# EAGLE schematic sch (EAGLE 9.3.2)
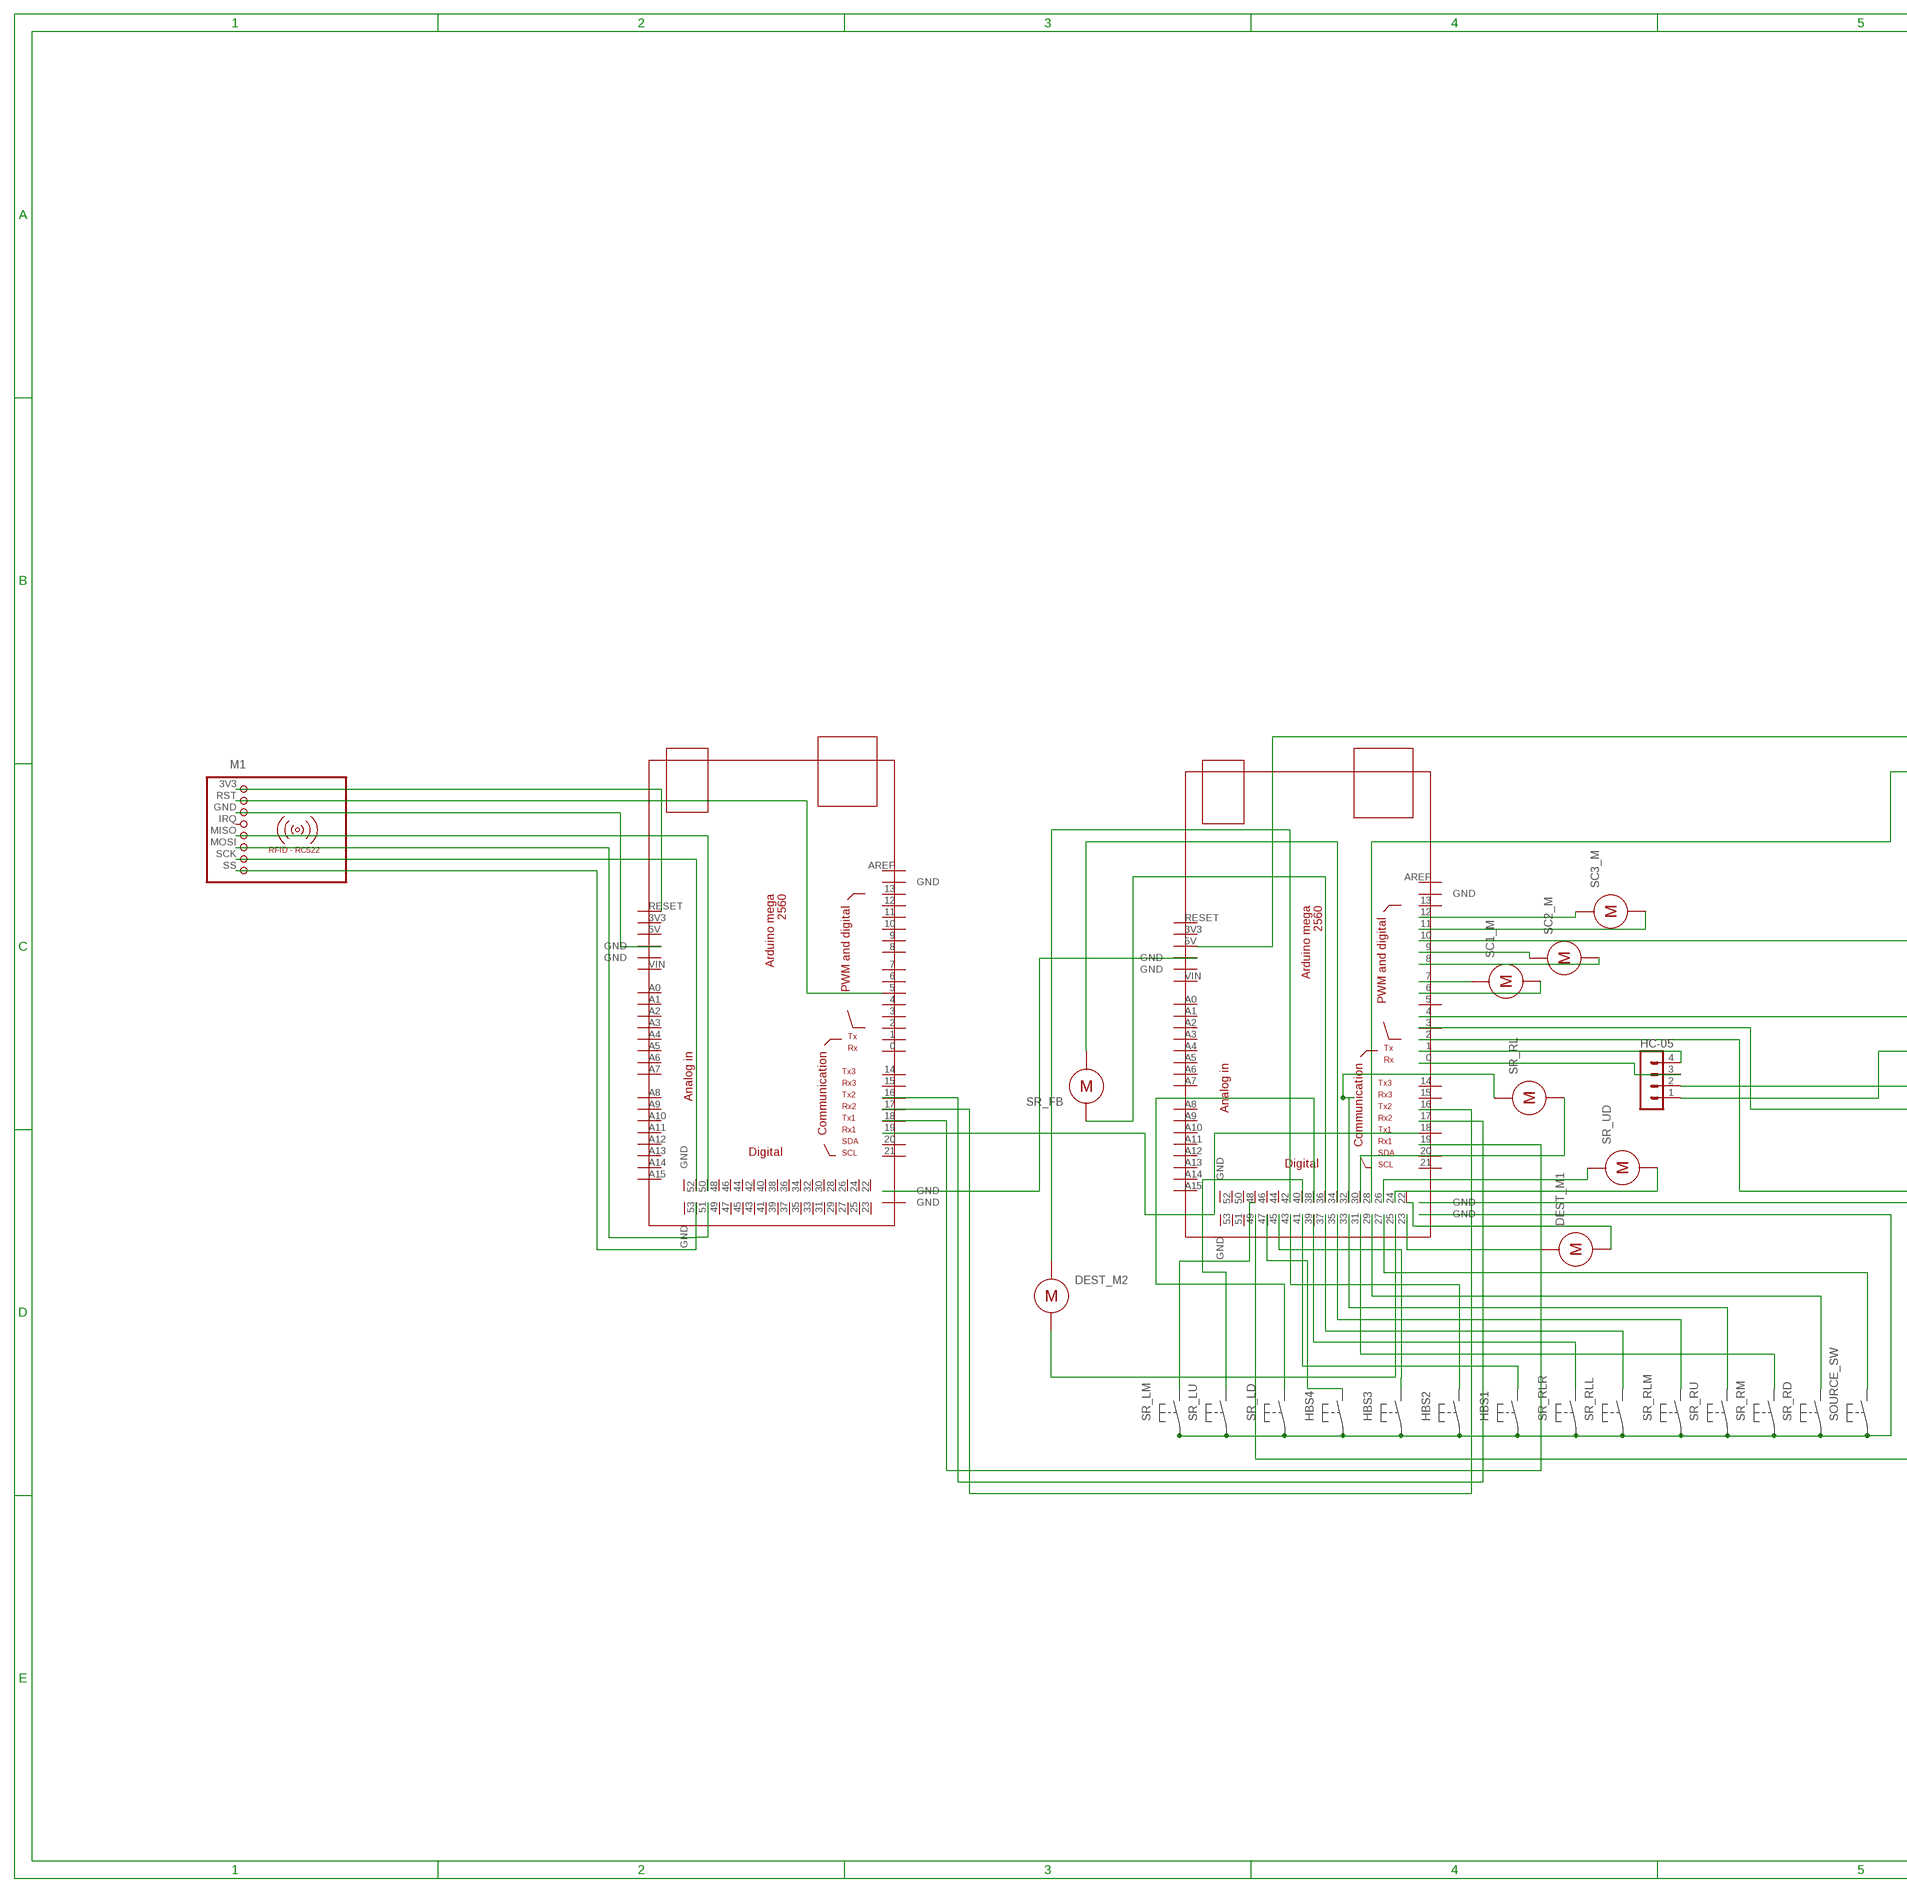
[diagram p0: schematic, sheet 1, part 1 of 2]
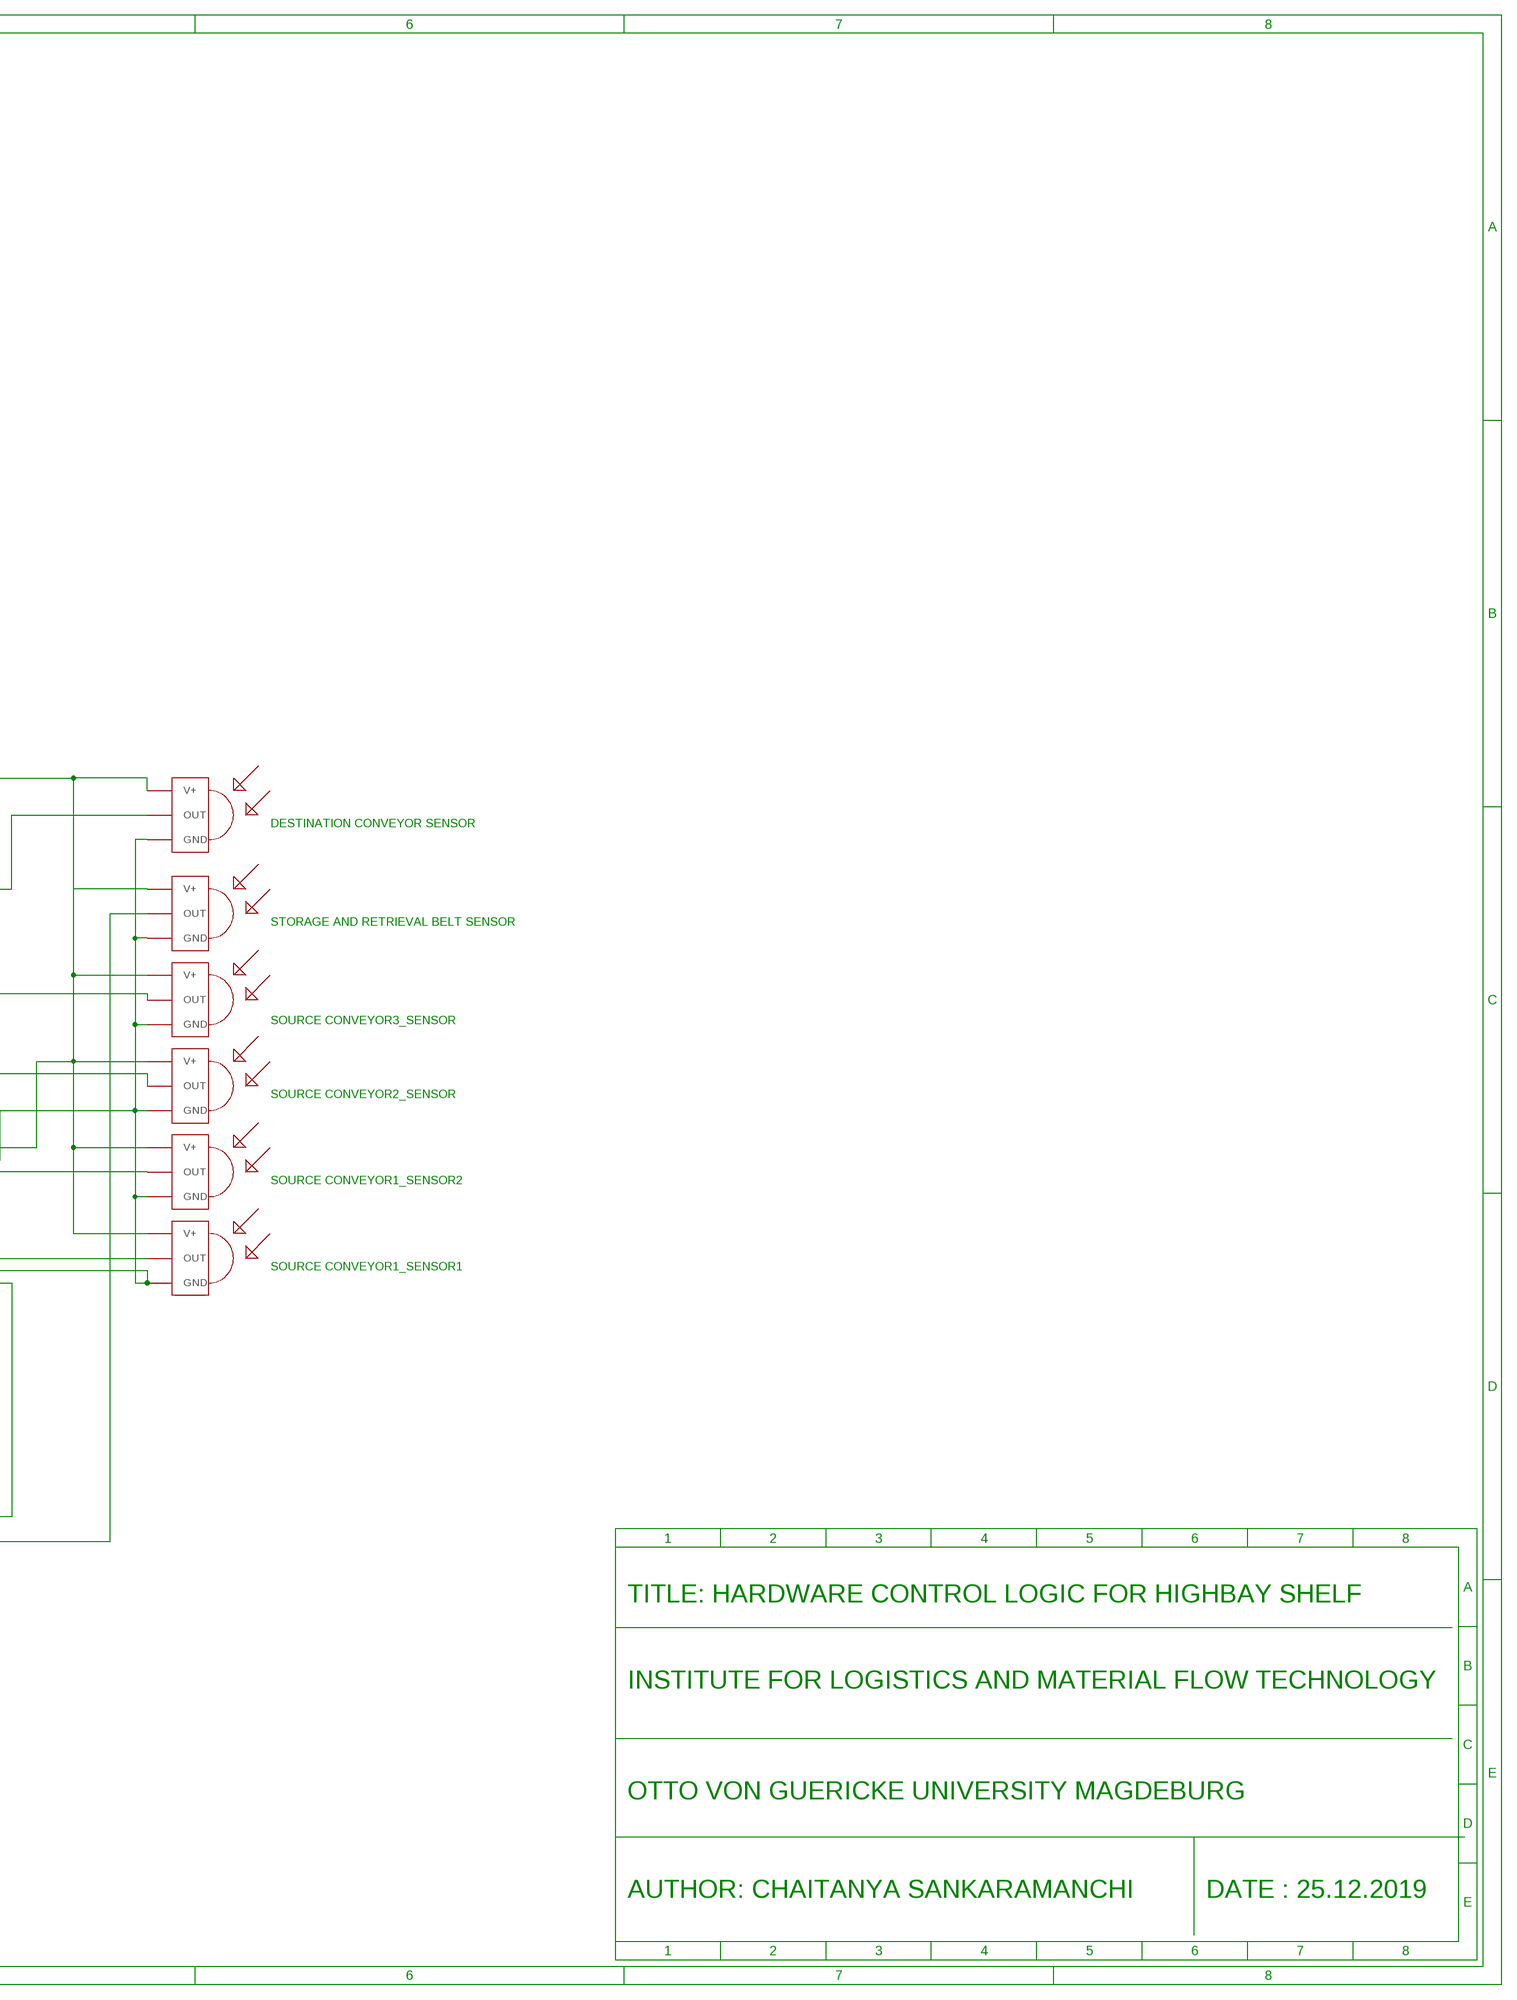
[diagram p1: schematic, sheet 1, part 2 of 2]

## Parts
DEST_M1  308-100  [308-100]
DEST_M2  308-100  [308-100]
HC-05  MA04-1  [MA04-1]
M1  RFID-RC522  [RFID-RC522]
SC1_M  308-100  [308-100]
SC1_SENS1  TSOP1730  [TSOP17XX]
SC1_SENS2  TSOP1730  [TSOP17XX]
SC2_M  308-100  [308-100]
SC2_SENS  TSOP1730  [TSOP17XX]
SC3_M  308-100  [308-100]
SC3_SENS  TSOP1730  [TSOP17XX]
SR_FB  308-100  [308-100]
SR_RL  308-100  [308-100]
SR_UD  308-100  [308-100]
SRB_SENS  TSOP1730  [TSOP17XX]
SRB_SENS1  TSOP1730  [TSOP17XX]
U$1  MEGA_DEVICE  [MEGAOUTLINE]
U$2  MEGA_DEVICE  [MEGAOUTLINE]

## Nets
N$1: U$1.48
N$2: U$1.40
N$3: U$1.38
N$4: U$1.47
N$5: U$1.45
N$6: U$1.43
N$7: U$1.41
N$8: U$1.39
N$9: U$1.31
N$10: U$1.37
N$11: U$1.35
N$12: U$1.33
N$13: U$1.29
N$14: U$1.27
N$15: U$1.GND@5(GND)
N$16: SC1_SENS1.OUT U$1.2
N$17: SC1_SENS2.OUT U$1.3
N$18: SC2_SENS.OUT U$1.4
N$19: SC3_SENS.OUT U$1.10
N$20: SRB_SENS.OUT U$1.49
N$21: HC-05.2 SC1_SENS1.V+ SC1_SENS2.V+ SC2_SENS.V+ SC3_SENS.V+ SRB_SENS1.V+ SRB_SENS.V+ U$1.5V
N$22: HC-05.1 SC1_SENS1.GND SC1_SENS2.GND SC2_SENS.GND SC3_SENS.GND SRB_SENS1.GND SRB_SENS.GND U$1.GND@4(GND)
N$23: SC1_M.POS U$1.7
N$24: SC1_M.NEG U$1.6
N$25: SC2_M.POS U$1.9
N$26: SC2_M.NEG U$1.8
N$27: SC3_M.POS U$1.12
N$28: SC3_M.NEG U$1.11
N$29: SR_UD.POS U$1.26
N$30: SR_UD.NEG U$1.24
N$31: U$1.32
N$32: SR_RL.NEG U$1.20 U$1.30
N$33: SR_FB.NEG U$1.34
N$34: SR_FB.POS U$1.36
N$35: DEST_M1.NEG U$1.22
N$36: DEST_M1.POS U$1.23
N$37: DEST_M2.NEG U$1.25
N$38: DEST_M2.POS U$1.42
N$39: SR_RL.POS
N$40: U$1.18 U$2.19
N$41: U$1.19 U$2.18
N$42: U$1.17 U$2.16
N$43: U$1.16 U$2.17
N$44: U$1.GND@2(GND) U$2.GND@4(GND)
N$45: M1.3V3 U$2.RESET
N$46: HC-05.4 U$1.1
N$47: HC-05.3 U$1.0
N$50: SRB_SENS1.OUT U$1.28
N$52: M1.RST U$2.5
N$53: M1.GND U$2.GND@2(GND)
N$54: M1.MISO U$2.50
N$55: M1.MOSI U$2.51
N$56: M1.SCK U$2.52
N$57: M1.SS U$2.53
Unconnected: M1.IRQ U$1.3V3 U$1.5 U$1.13 U$1.14 U$1.15 U$1.21 U$1.44 U$1.46 U$1.50 U$1.51 U$1.52 U$1.53 U$1.A0 U$1.A1 U$1.A2 U$1.A3 U$1.A4 U$1.A5 U$1.A6 U$1.A7 U$1.A8 U$1.A9 U$1.A10 U$1.A11 U$1.A12 U$1.A13 U$1.A14 U$1.A15 U$1.AREF U$1.GND@1(GND) U$1.GND@3(GND) U$1.GND@6(GND) U$1.GND@7(GND) U$1.RESET U$1.VIN U$2.0 U$2.1 U$2.2 U$2.3 U$2.3V3 U$2.4 U$2.5V U$2.6 U$2.7 U$2.8 U$2.9 U$2.10 U$2.11 U$2.12 U$2.13 U$2.14 U$2.15 U$2.20 U$2.21 U$2.22 U$2.23 U$2.24 U$2.25 U$2.26 U$2.27 U$2.28 U$2.29 U$2.30 U$2.31 U$2.32 U$2.33 U$2.34 U$2.35 U$2.36 U$2.37 U$2.38 U$2.39 U$2.40 U$2.41 U$2.42 U$2.43 U$2.44 U$2.45 U$2.46 U$2.47 U$2.48 U$2.49 U$2.A0 U$2.A1 U$2.A2 U$2.A3 U$2.A4 U$2.A5 U$2.A6 U$2.A7 U$2.A8 U$2.A9 U$2.A10 U$2.A11 U$2.A12 U$2.A13 U$2.A14 U$2.A15 U$2.AREF U$2.GND@1(GND) U$2.GND@3(GND) U$2.GND@5(GND) U$2.GND@6(GND) U$2.GND@7(GND) U$2.VIN

## Notes on the sheet
- DESTINATION CONVEYOR SENSOR
- STORAGE AND RETRIEVAL BELT SENSOR
- SOURCE CONVEYOR3_SENSOR
- SOURCE CONVEYOR2_SENSOR
- SOURCE CONVEYOR1_SENSOR2
- SOURCE CONVEYOR1_SENSOR1
- TITLE: HARDWARE CONTROL LOGIC FOR HIGHBAY SHELF
- INSTITUTE FOR LOGISTICS AND MATERIAL FLOW TECHNOLOGY
- OTTO VON GUERICKE UNIVERSITY MAGDEBURG
- AUTHOR: CHAITANYA SANKARAMANCHI | DATE : 25.12.2019

## Library data of the parts
DEST_M1 DEST_M2 SC1_M SC2_M SC3_M SR_FB SR_RL SR_UD = motor:308-100: Pico Vibe 8mm Vibration Motor - 3mm Type; PRECISION_MICRODRIVES: 308-100
HC-05 = con-lstb:MA04-1: PIN HEADER; OC_FARNELL: unknown; OC_NEWARK: unknown
M1 = mfrc522-module:RFID-RC522: RFID-RC522 MFRC-522 based breakout board
SC1_SENS1 SC1_SENS2 SC2_SENS SC3_SENS SRB_SENS SRB_SENS1 = tsop:TSOP1730: IR Receiver and Demodulator
U$1 U$2 = ArduinoMegaOutline:MEGA_DEVICE: mega card as device